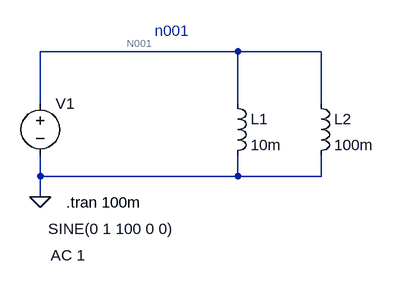
[diagram p0: schematic Yoneda-p73_v-2_2Coisl+Sine-wave.asc]
Yoneda-p73_v-2_2Coisl+Sine-wave.asc, the LTspice schematic file:
Version 4
SHEET 1 880 680
WIRE 400 32 96 32
WIRE 528 32 400 32
WIRE 96 112 96 32
WIRE 400 112 400 32
WIRE 528 112 528 32
WIRE 96 224 96 192
WIRE 400 224 400 192
WIRE 400 224 96 224
WIRE 528 224 528 192
WIRE 528 224 400 224
WIRE 96 256 96 224
FLAG 96 256 0
SYMBOL voltage 96 96 R0
WINDOW 3 12 209 Left 2
WINDOW 123 16 250 Left 2
WINDOW 39 0 0 Left 2
SYMATTR InstName V1
SYMATTR Value SINE(0 1 100 0 0)
SYMATTR Value2 AC 1
SYMBOL ind 384 96 R0
SYMATTR InstName L1
SYMATTR Value 10m
SYMBOL ind 512 96 R0
SYMATTR InstName L2
SYMATTR Value 100m
TEXT 136 264 Left 2 !.tran 100m
TEXT 272 0 Left 2 ;n001

The netlist it stands for:
* Yoneda-p73_v-2_2Coisl+Sine-wave.asc
V1 N001 0 SINE(0 1 100 0 0) AC 1
L1 N001 0 10m
L2 N001 0 100m
.tran 100m
* n001
.backanno
.end

* Results of the author's LTspice run, read from the files saved beside the schematic
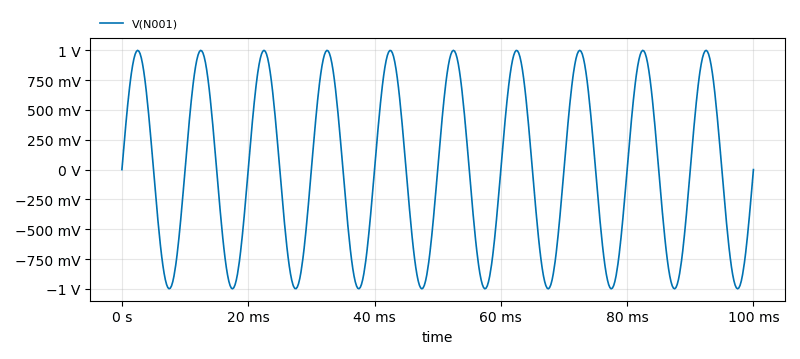
[diagram p1: Transient Analysis of Yoneda-p73_v-2_2Coisl+Sine-wave.asc, plotted from the saved traces]
* Transient Analysis, 1 run:
*   V(N001): min -999.1 mV, max 999.1 mV, average -3.523 µV, rms 706.3 mV, last 0 V